# Altium schematic sheet Sheet1.SchDoc
size A
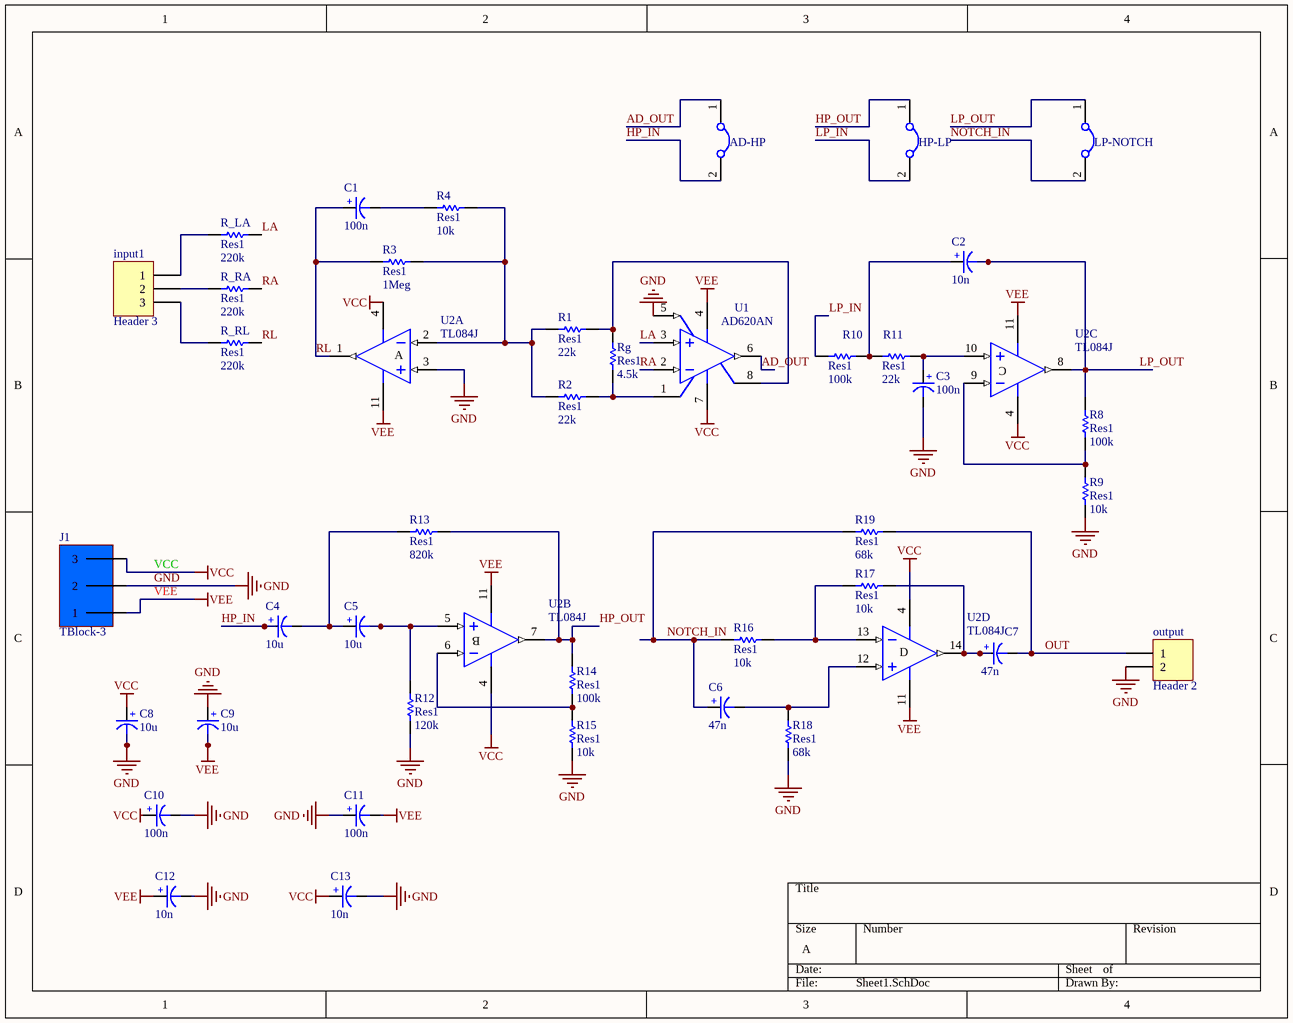
[diagram p0: Sheet1.SchDoc]

## Parts
AD-HP  Jumper  [Header 2X1]  (value not drawn)
C1  100n  [ELEC-CAP-RAD10-20]
C2  10n  [ELEC-CAP-RAD10-20]
C3  100n  [ELEC-CAP-RAD10-20]
C4  10u  [ELEC-CAP-RAD10-20]
C5  10u  [ELEC-CAP-RAD10-20]
C6  47n  [ELEC-CAP-RAD10-20]
C7  47n  [ELEC-CAP-RAD10-20]
C8  10u  [ELEC-CAP-RAD10-20]
C9  10u  [ELEC-CAP-RAD10-20]
C10  100n  [ELEC-CAP-RAD10-20]
C11  100n  [ELEC-CAP-RAD10-20]
C12  10n  [ELEC-CAP-RAD10-20]
C13  10n  [ELEC-CAP-RAD10-20]
HP-LP  Jumper  [Header 2X1]  (value not drawn)
input1  Header 3  [HDR1X3]
J1  TBlock-3  [KF300-3 PIN]
LP-NOTCH  Jumper  [Header 2X1]  (value not drawn)
output  Header 2  [HDR1X2]
R1  Res1  value 22k  [AXIAL-0.3]
R2  Res1  value 22k  [AXIAL-0.3]
R3  Res1  value 1Meg  [AXIAL-0.3]
R4  Res1  value 10k  [AXIAL-0.3]
R8  Res1  value 100k  [AXIAL-0.3]
R9  Res1  value 10k  [AXIAL-0.3]
R10  Res1  value 100k  [AXIAL-0.3]
R11  Res1  value 22k  [AXIAL-0.3]
R12  Res1  value 120k  [AXIAL-0.3]
R13  Res1  value 820k  [AXIAL-0.3]
R14  Res1  value 100k  [AXIAL-0.3]
R15  Res1  value 10k  [AXIAL-0.3]
R16  Res1  value 10k  [AXIAL-0.3]
R17  Res1  value 10k  [AXIAL-0.3]
R18  Res1  value 68k  [AXIAL-0.3]
R19  Res1  value 68k  [AXIAL-0.3]
R_LA  Res1  value 220k  [AXIAL-0.3]
R_RA  Res1  value 220k  [AXIAL-0.3]
R_RL  Res1  value 220k  [AXIAL-0.3]
Rg  Res1  value 4.5k  [AXIAL-0.3]
U1  AD620AN  [N-8]
U2  TL084J  [J014]  (parts A,B,C,D of 4)

## Nets
GND: C3.1(-) C8.1(-) C9.2(+) C10.1(-) C11.2(+) C12.1(-) C13.1(-) J1.2 output.2 R9.1 R12.1 R15.1 R18.1 U1.5(REF) U2.3(IN+)
VCC: C8.2(+) C13.2(+) J1.3 U1.7(V+) U2.4(V+)
VEE: C9.1(-) C11.1(-) C12.2(+) J1.1 U1.4(V-) U2.11(V-)
AD_OUT: AD-HP.1 U1.6(OUT)
HP_IN: AD-HP.2 C4.2(+)
HP_OUT: HP-LP.1 R13.2 R14.2 U2.7(OUT)
LA: R_LA.1 U1.3(+IN)
LP_IN: HP-LP.2 R10.2
LP_OUT: C2.1(-) LP-NOTCH.1 R8.2 U2.8(OUT)
NOTCH_IN: C6.2(+) LP-NOTCH.2 R16.2 R19.2
OUT: C7.1(-) output.1 R19.1
RA: R_RA.2 U1.2(-IN)
RL: C1.2(+) R3.2 R_RL.2 U2.1(OUT)
NetC1_1: C1.1(-) R4.2
NetC2_2: C2.2(+) R10.1 R11.2
NetC3_2: C3.2(+) R11.1 U2.10(IN+)
NetC4_1: C4.1(-) C5.2(+) R13.1
NetC5_1: C5.1(-) R12.2 U2.5(IN+)
NetC6_1: C6.1(-) R18.2 U2.12(IN+)
NetC7_2: C7.2(+) R17.1 U2.14(OUT)
Netinput1_1: input1.1 R_LA.2
Netinput1_2: input1.2 R_RA.1
Netinput1_3: input1.3 R_RL.1
NetR1_1: R1.1 Rg.2 U1.8(RG)
NetR1_2: R1.2 R2.2 R3.1 R4.1 U2.2(IN-)
NetR2_1: R2.1 Rg.1 U1.1(RG)
NetR8_1: R8.1 R9.2 U2.9(IN-)
NetR14_1: R14.1 R15.2 U2.6(IN-)
NetR16_1: R16.1 R17.2 U2.13(IN-)

Not connected (* = marked no-connect by the designer): C10 2(+)

## Notes on the sheet
- Labels drawn without touching a wire or pin: VCC
- (in symbol TL084J, part A) A
- (in symbol TL084J, part B) B
- (in symbol TL084J, part C) C
- (in symbol TL084J, part D) D

## Library data of the parts
C1-C13 = Capacitor Electrolytic: Electrolytic Capacitor
input1 = Header 3: Header, 3-Pin; LatestRevisionDate: 17-Jul-2002; LatestRevisionNote: Re-released for DXP Platform.; Publisher: Altium Limited
output = Header 2: Header, 2-Pin; LatestRevisionDate: 17-Jul-2002; LatestRevisionNote: Re-released for DXP Platform.; Publisher: Altium Limited
R1-R4 R8-R19 R_LA R_RA R_RL Rg = Res1: Resistor; Published: 8-Jun-2000; LatestRevisionDate: 17-Jul-2002; LatestRevisionNote: Re-released for DXP Platform.; PackageReference: AXIAL-0.3; Publisher: Altium Limited
U1 = AD620AN: Low-Cost, Low-Power Instrumentation Amplifier; Published: 8-Jun-2000; LatestRevisionDate: 04-Mar-2005; LatestRevisionNote: Stylized 3D Model Added.; DatasheetVersion: REV.D 1998; PackageVersion: revA; PackageReference: N-8; Publisher: Altium Limited; PackageDescription: DIP; 8 Leads; Row Spacing 7.62 mm; Pitch 2.54 mm; ComponentLink1Description: Manufacturer Link; ComponentLink1URL: http://www.analog.com/en/prod/0%2C2877%2CAD620%2C00.html; ComponentLink2Description: Datasheet; ComponentLink2URL: http://www.analog.com/UploadedFiles/Data_Sheets/897653854AD620_g.pdf
U2 = TL084J: JFET-Input Operational Amplifier; Published: 16-Jan-2001; LatestRevisionDate: 04-Mar-2005; LatestRevisionNote: Stylized 3D Model Added.; DatasheetVersion: Feb-1999; PackageVersion: Jun-1999; PackageReference: J014; Publisher: Altium Limited; PackageDescription: DIP; 14 Leads; Row Spacing 7.62 mm; Pitch 2.54 mm; ComponentLink1Description: Manufacturer Link; ComponentLink1URL: http://www.ti.com/; ComponentLink2Description: Datasheet; ComponentLink2URL: http://www-s.ti.com/sc/ds/tl084.pdf